# EasyEDA schematic 1-Schematic_Breadboard Card.json
TITLE: Sheet_1; REV: 1.0; Date: 2024-12-17; Sheet: 1/1; Drawn By: Joshua Byington; Company: Your Company
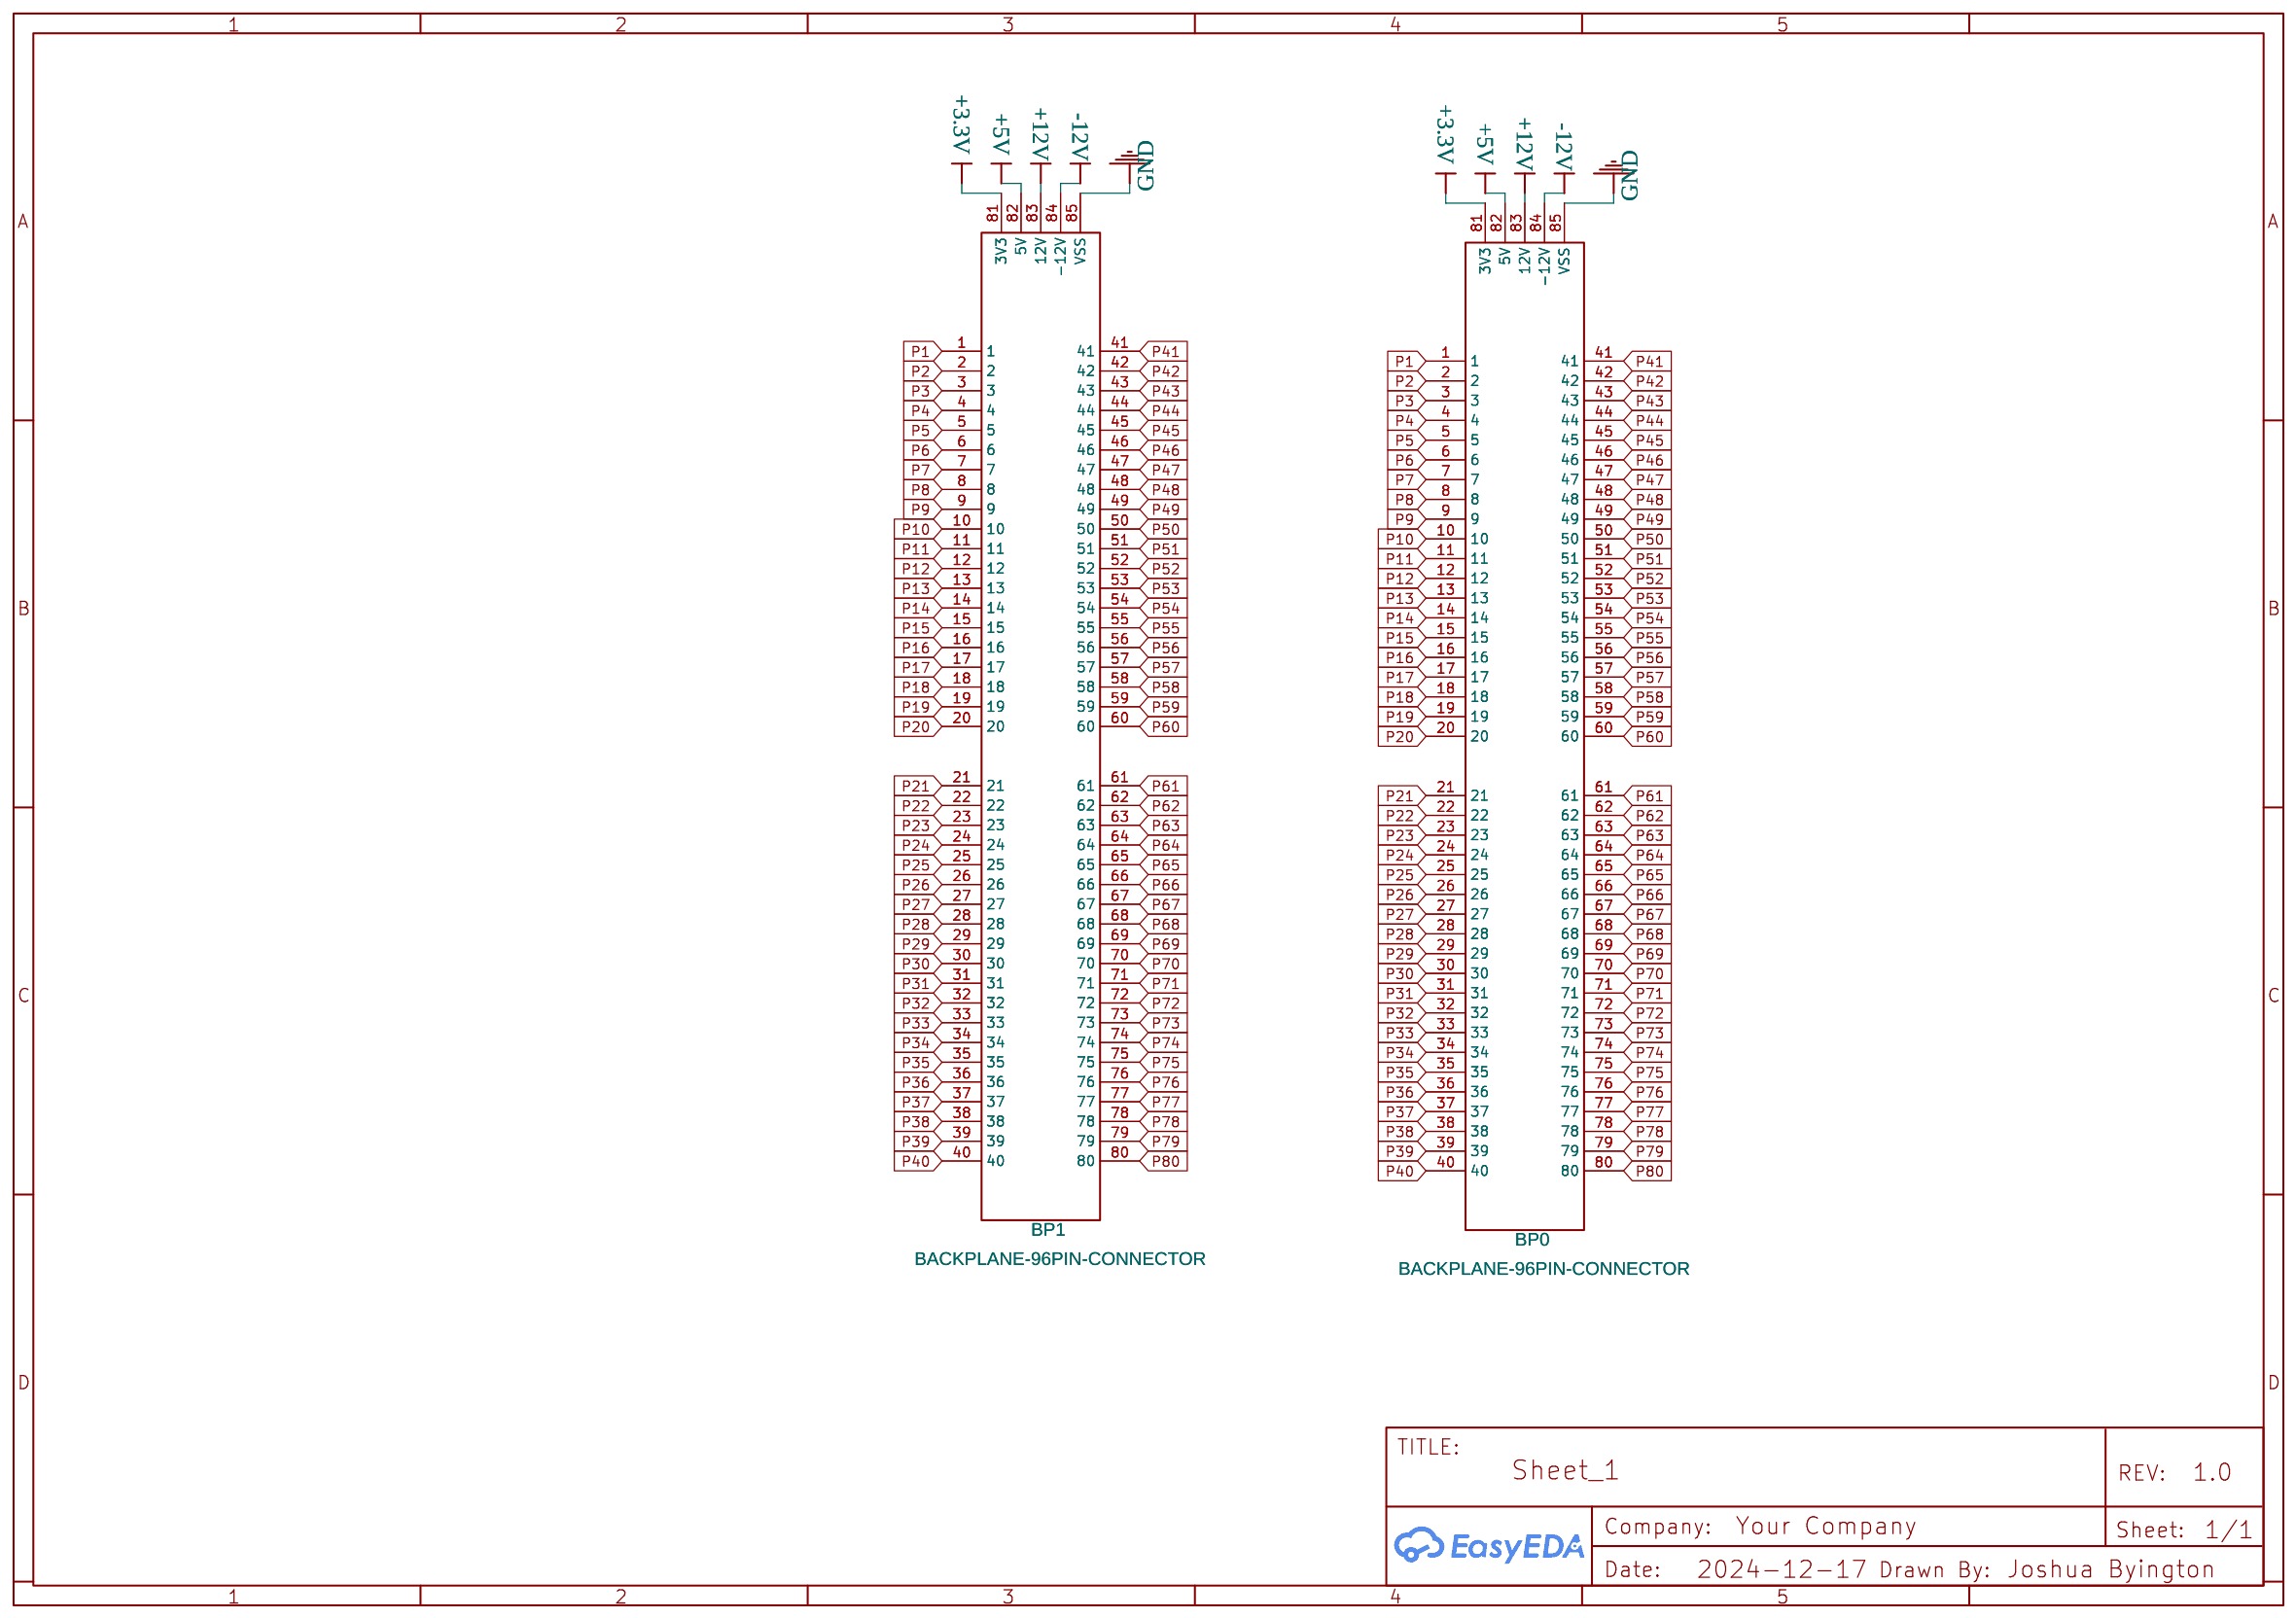
[diagram p0: schematic sheet]

## Parts
BP0  BACKPLANE-96PIN-CONNECTOR  [BACKPLANE-96PIN-CONNECTOR]
BP1  BACKPLANE-96PIN-CONNECTOR  [BACKPLANE-96PIN-CONNECTOR]

## Library data of the parts
BP0 BP1 = BACKPLANE-96PIN-CONNECTOR: Contributor: Joshua Byington

## Nets
+3.3V: BP0.81(3V3) BP1.81(3V3)
+5V: BP0.82(5V) BP1.82(5V)
+12V: BP0.83(12V) BP1.83(12V)
-12V: BP0.84(-12V) BP1.84(-12V)
GND: BP0.85(VSS) BP1.85(VSS)
P1: BP0.1 BP1.1
P2: BP0.2 BP1.2
P3: BP0.3 BP1.3
P4: BP0.4 BP1.4
P5: BP0.5 BP1.5
P6: BP0.6 BP1.6
P7: BP0.7 BP1.7
P8: BP0.8 BP1.8
P9: BP0.9 BP1.9
P10: BP0.10 BP1.10
P11: BP0.11 BP1.11
P12: BP0.12 BP1.12
P13: BP0.13 BP1.13
P14: BP0.14 BP1.14
P15: BP0.15 BP1.15
P16: BP0.16 BP1.16
P17: BP0.17 BP1.17
P18: BP0.18 BP1.18
P19: BP0.19 BP1.19
P20: BP0.20 BP1.20
P21: BP0.21 BP1.21
P22: BP0.22 BP1.22
P23: BP0.23 BP1.23
P24: BP0.24 BP1.24
P25: BP0.25 BP1.25
P26: BP0.26 BP1.26
P27: BP0.27 BP1.27
P28: BP0.28 BP1.28
P29: BP0.29 BP1.29
P30: BP0.30 BP1.30
P31: BP0.31 BP1.31
P32: BP0.32 BP1.32
P33: BP0.33 BP1.33
P34: BP0.34 BP1.34
P35: BP0.35 BP1.35
P36: BP0.36 BP1.36
P37: BP0.37 BP1.37
P38: BP0.38 BP1.38
P39: BP0.39 BP1.39
P40: BP0.40 BP1.40
P41: BP0.41 BP1.41
P42: BP0.42 BP1.42
P43: BP0.43 BP1.43
P44: BP0.44 BP1.44
P45: BP0.45 BP1.45
P46: BP0.46 BP1.46
P47: BP0.47 BP1.47
P48: BP0.48 BP1.48
P49: BP0.49 BP1.49
P50: BP0.50 BP1.50
P51: BP0.51 BP1.51
P52: BP0.52 BP1.52
P53: BP0.53 BP1.53
P54: BP0.54 BP1.54
P55: BP0.55 BP1.55
P56: BP0.56 BP1.56
P57: BP0.57 BP1.57
P58: BP0.58 BP1.58
P59: BP0.59 BP1.59
P60: BP0.60 BP1.60
P61: BP0.61 BP1.61
P62: BP0.62 BP1.62
P63: BP0.63 BP1.63
P64: BP0.64 BP1.64
P65: BP0.65 BP1.65
P66: BP0.66 BP1.66
P67: BP0.67 BP1.67
P68: BP0.68 BP1.68
P69: BP0.69 BP1.69
P70: BP0.70 BP1.70
P71: BP0.71 BP1.71
P72: BP0.72 BP1.72
P73: BP0.73 BP1.73
P74: BP0.74 BP1.74
P75: BP0.75 BP1.75
P76: BP0.76 BP1.76
P77: BP0.77 BP1.77
P78: BP0.78 BP1.78
P79: BP0.79 BP1.79
P80: BP0.80 BP1.80
